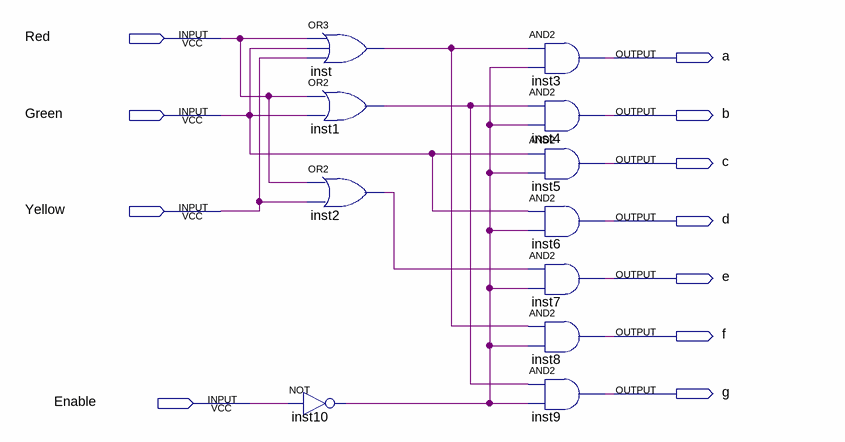
[diagram p0: schematic sheet]
// Quartus schematic FNDarray2.bdf as structural Verilog: 11 symbols, 11 pins
module FNDarray2 (
  input  Red,
  input  Green,
  input  Yellow,
  input  Enable,
  output a,
  output b,
  output c,
  output d,
  output e,
  output f,
  output g
);

  wire inst1_out, inst2_out, inst10_out, inst_out;

  or inst (inst_out, Red, Green, Yellow);
  or inst1 (inst1_out, Red, Green);
  or inst2 (inst2_out, Red, Yellow);
  not inst10 (inst10_out, Enable);
  and inst3 (a, inst_out, inst10_out);
  and inst4 (b, inst1_out, inst10_out);
  and inst5 (c, Green, inst10_out);
  and inst6 (d, Green, inst10_out);
  and inst7 (e, inst2_out, inst10_out);
  and inst8 (f, inst_out, inst10_out);
  and inst9 (g, inst1_out, inst10_out);
endmodule
